# EAGLE schematic board (EAGLE 6.4)
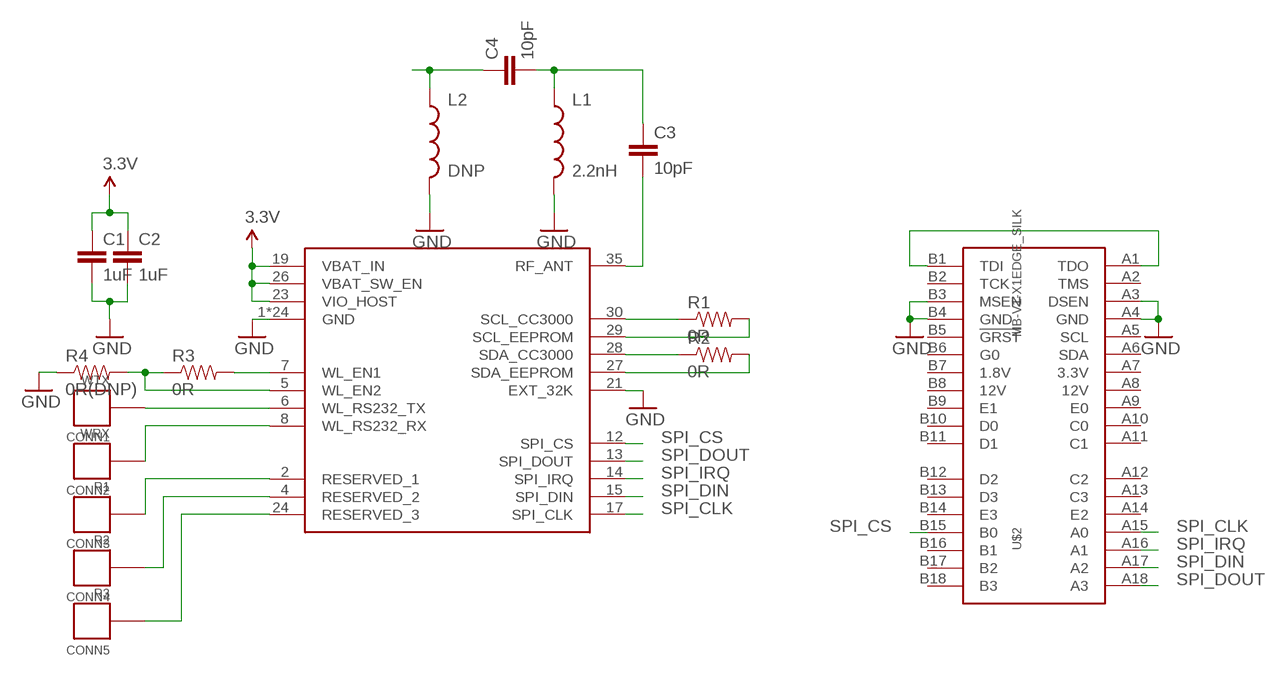
[diagram p0: schematic, sheet 1]

## Parts
C1  1uF  CAP0603  [0603-CAP]
C2  1uF  CAP0603  [0603-CAP]
C3  10pF  CAP0402-CAP  [0402-CAP]
C4  10pF  CAP0402-CAP  [0402-CAP]
CONN1  WTX  CONNECTOR22AWG  [HOLE_22AWG]
CONN2  WRX  CONNECTOR22AWG  [HOLE_22AWG]
CONN3  R1  CONNECTOR22AWG  [HOLE_22AWG]
CONN4  R2  CONNECTOR22AWG  [HOLE_22AWG]
CONN5  R3  CONNECTOR22AWG  [HOLE_22AWG]
L1  2.2nH  INDUCTOR0603  [0603]
L2  DNP  INDUCTOR0603  [0603]
R1  0R  RESISTOR0603  [0603-RES]
R2  0R  RESISTOR0603  [0603-RES]
R3  0R  RESISTOR0603  [0603-RES]
R4  0R(DNP)  RESISTOR0603  [0603-RES]
U$1  CC3000  [CC3000]
U$2  MB-V1-X1EDGE_SILK  [MB-V1-X1-EDGE]

## Nets
3.3V: C1.1 C2.1 U$1.19(VBAT_IN) U$1.23(VIO_HOST) U$1.26(VBAT_SW_EN)
GND: C1.2 C2.2 L1.2 L2.2 R4.1 U$1.1(GND) U$1.9(GND) U$1.10(GND) U$1.11(GND) U$1.16(GND) U$1.18(GND) U$1.20(GND) U$1.21(EXT_32K) U$1.22(GND) U$1.25(GND) U$1.31(GND) U$1.32(GND) U$1.33(GND) U$1.34(GND) U$1.36(GND) U$1.37(GND) U$1.38(GND) U$1.39(GND) U$1.40(GND) U$1.41(GND) U$1.42(GND) U$1.43(GND) U$1.44(GND) U$1.45(GND) U$1.46(GND) U$2.A3(DSEN) U$2.A4(GND) U$2.B3(MSEN) U$2.B4(GND)
N$1: R1.1 U$1.30(SCL_CC3000)
N$2: R1.2 U$1.29(SCL_EEPROM)
N$3: R2.1 U$1.28(SDA_CC3000)
N$4: R2.2 U$1.27(SDA_EEPROM)
N$5: R3.2 U$1.7(WL_EN1)
N$6: R3.1 R4.2 U$1.5(WL_EN2)
N$7: CONN1.P U$1.6(WL_RS232_TX)
N$8: CONN2.P U$1.8(WL_RS232_RX)
N$9: CONN3.P U$1.2(RESERVED_1)
N$10: CONN4.P U$1.4(RESERVED_2)
N$11: CONN5.P U$1.24(RESERVED_3)
N$12: C3.2 U$1.35(RF_ANT)
N$13: C3.1 C4.2 L1.1
N$14: U$2.A1(TDO) U$2.B1(TDI)
N$15: C4.1 L2.1
SPI_CLK: U$1.17(SPI_CLK) U$2.A15(A0)
SPI_CS: U$1.12(SPI_CS) U$2.B15(B0)
SPI_DIN: U$1.15(SPI_DIN) U$2.A17(A2)
SPI_DOUT: U$1.13(SPI_DOUT) U$2.A18(A3)
SPI_IRQ: U$1.14(SPI_IRQ) U$2.A16(A1)
Unconnected: U$2.A2(TMS) U$2.A5(SCL) U$2.A6(SDA) U$2.A7(3.3V) U$2.A8(12V) U$2.A9(E0) U$2.A10(C0) U$2.A11(C1) U$2.A12(C2) U$2.A13(C3) U$2.A14(E2) U$2.B2(TCK) U$2.B5(!GRST) U$2.B6(G0) U$2.B7(1.8V) U$2.B8(12V) U$2.B9(E1) U$2.B10(D0) U$2.B11(D1) U$2.B12(D2) U$2.B13(D3) U$2.B14(E3) U$2.B16(B1) U$2.B17(B2) U$2.B18(B3)

## Library data of the parts
C1-C4 = kmod-passives:CAP: Capacitor Standard 0603 ceramic capacitor, and 0.1" leaded capacitor.
CONN1-CONN5 = kmod-nonparts:CONNECTOR: Collection of holes/pads for testing/connecting
L1 L2 = kmod-passives:INDUCTOR
R1-R4 = kmod-passives:RESISTOR: Resistor Basic schematic elements and footprints for 0603, 1206, and PTH resistors.
U$1 = kmod-testing:CC3000
U$2 = kmod-connectors:MB-V1-X1